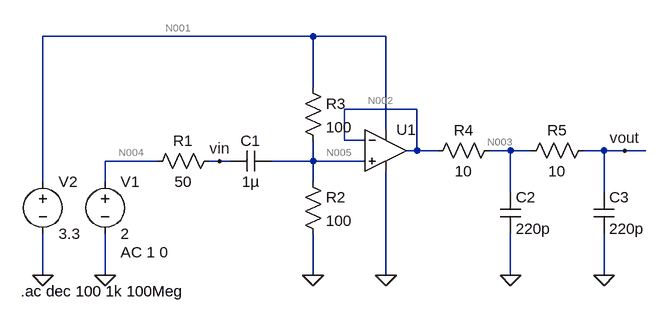
[diagram p0: schematic afe.asc]
afe.asc, the LTspice schematic file:
Version 4
SHEET 1 880 680
WIRE -464 16 -880 16
WIRE -352 16 -464 16
WIRE -464 96 -464 16
WIRE -304 128 -416 128
WIRE -352 160 -352 16
WIRE -416 176 -416 128
WIRE -384 176 -416 176
WIRE -304 192 -304 128
WIRE -304 192 -320 192
WIRE -272 192 -304 192
WIRE -160 192 -192 192
WIRE -128 192 -160 192
WIRE -16 192 -48 192
WIRE 16 192 -16 192
WIRE 48 192 16 192
WIRE -704 208 -784 208
WIRE -608 208 -624 208
WIRE -592 208 -608 208
WIRE -464 208 -464 176
WIRE -464 208 -528 208
WIRE -384 208 -464 208
WIRE -880 240 -880 16
WIRE -784 240 -784 208
WIRE -464 240 -464 208
WIRE -160 256 -160 192
WIRE -16 256 -16 192
WIRE -880 384 -880 320
WIRE -784 384 -784 320
WIRE -464 384 -464 320
WIRE -352 384 -352 224
WIRE -160 384 -160 320
WIRE -16 384 -16 320
FLAG -464 384 0
FLAG -784 384 0
FLAG -352 384 0
FLAG -880 384 0
FLAG -160 384 0
FLAG -16 384 0
FLAG -608 208 vin
FLAG 16 192 vout
SYMBOL voltage -784 224 R0
WINDOW 123 24 124 Left 2
WINDOW 39 0 0 Left 0
SYMATTR InstName V1
SYMATTR Value 2
SYMATTR Value2 AC 1 0
SYMBOL res -608 192 R90
WINDOW 0 0 56 VBottom 2
WINDOW 3 32 56 VTop 2
SYMATTR InstName R1
SYMATTR Value 50
SYMBOL cap -528 192 R90
WINDOW 0 0 32 VBottom 2
WINDOW 3 32 32 VTop 2
SYMATTR InstName C1
SYMATTR Value 1µ
SYMBOL res -480 224 R0
SYMATTR InstName R2
SYMATTR Value 100
SYMBOL OpAmps\\UniversalOpAmp -352 192 R0
SYMATTR InstName U1
SYMATTR Value2 Avol=1Meg GBW=100Meg Vos=0
SYMBOL res -480 80 R0
SYMATTR InstName R3
SYMATTR Value 100
SYMBOL voltage -880 224 R0
WINDOW 123 0 0 Left 0
WINDOW 39 0 0 Left 0
SYMATTR InstName V2
SYMATTR Value 3.3
SYMBOL res -176 176 R90
WINDOW 0 0 56 VBottom 2
WINDOW 3 32 56 VTop 2
SYMATTR InstName R4
SYMATTR Value 10
SYMBOL res -32 176 R90
WINDOW 0 0 56 VBottom 2
WINDOW 3 32 56 VTop 2
SYMATTR InstName R5
SYMATTR Value 10
SYMBOL cap -176 256 R0
SYMATTR InstName C2
SYMATTR Value 220p
SYMBOL cap -32 256 R0
SYMATTR InstName C3
SYMATTR Value 220p
TEXT -914 408 Left 2 !.ac dec 100 1k 100Meg

The netlist it stands for:
* afe.asc
V1 N004 0 2 AC 1 0
R1 vin N004 50
C1 N005 vin 1µ
R2 N005 0 100
XU1 N005 N002 N001 0 N002 level1 Avol=1Meg GBW=100Meg Vos=0 En=0 Enk=0 In=0 Ink=0 Rin=500Meg  ; pins In+ In- V+ V- OUT
R3 N001 N005 100
V2 N001 0 3.3
R4 N003 N002 10
R5 vout N003 10
C2 N003 0 220p
C3 vout 0 220p
.ac dec 100 1k 100Meg
.lib UniversalOpAmp1.lib
.backanno
.end

* Results of the author's LTspice run, read from the files saved beside the schematic
* Operating Point, zero values left out:
*   V(n004) = 2 V
*   V(vin) = 2 V
*   V(n005) = 1.65 V
*   V(n002) = 1.65 V
*   V(n001) = 3.3 V
*   V(n003) = 1.65 V
*   V(vout) = 1.65 V
*   I(R2) = 16.5 mA
*   I(R3) = 16.5 mA
*   I(V2) = -16.5 mA
*   Ix(u1:3) = 3.3 nA
*   Ix(u1:4) = -3.3 nA
*   Ix(u1:5) = 1.19 nA
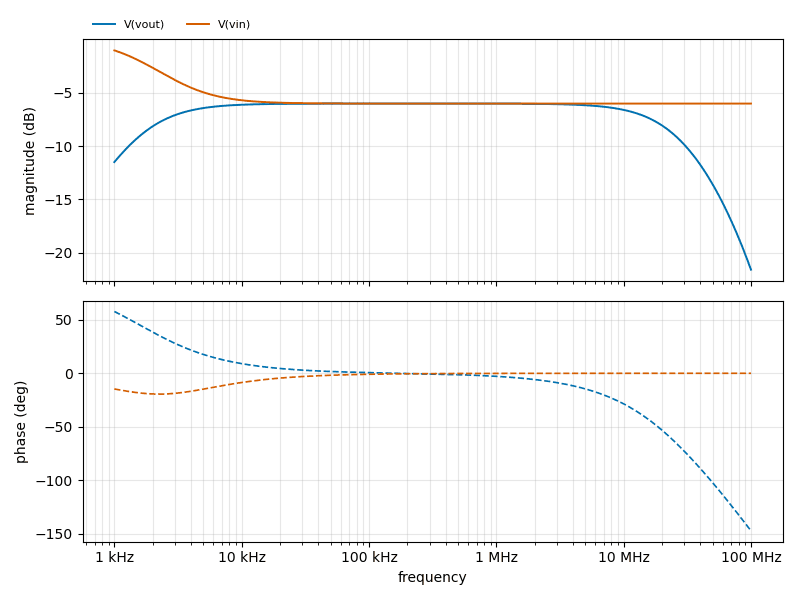
[diagram p1: AC Analysis of afe.asc, plotted from the saved traces]
* AC Analysis, 1 run:
*   V(vout): -11.50 dB at 1 kHz, -21.59 dB at 100 MHz, peak -6.02 dB at 204.2 kHz, 3 dB below the peak at 1.591 kHz and 25.41 MHz
*   V(vin): -1.04 dB at 1 kHz, -6.02 dB at 100 MHz, peak -1.04 dB at 1 kHz, 3 dB below the peak at 3.267 kHz